# Altium schematic sheet Main_Circuit.SchDoc
size A; SheetNumber: 1; SheetTotal: 1
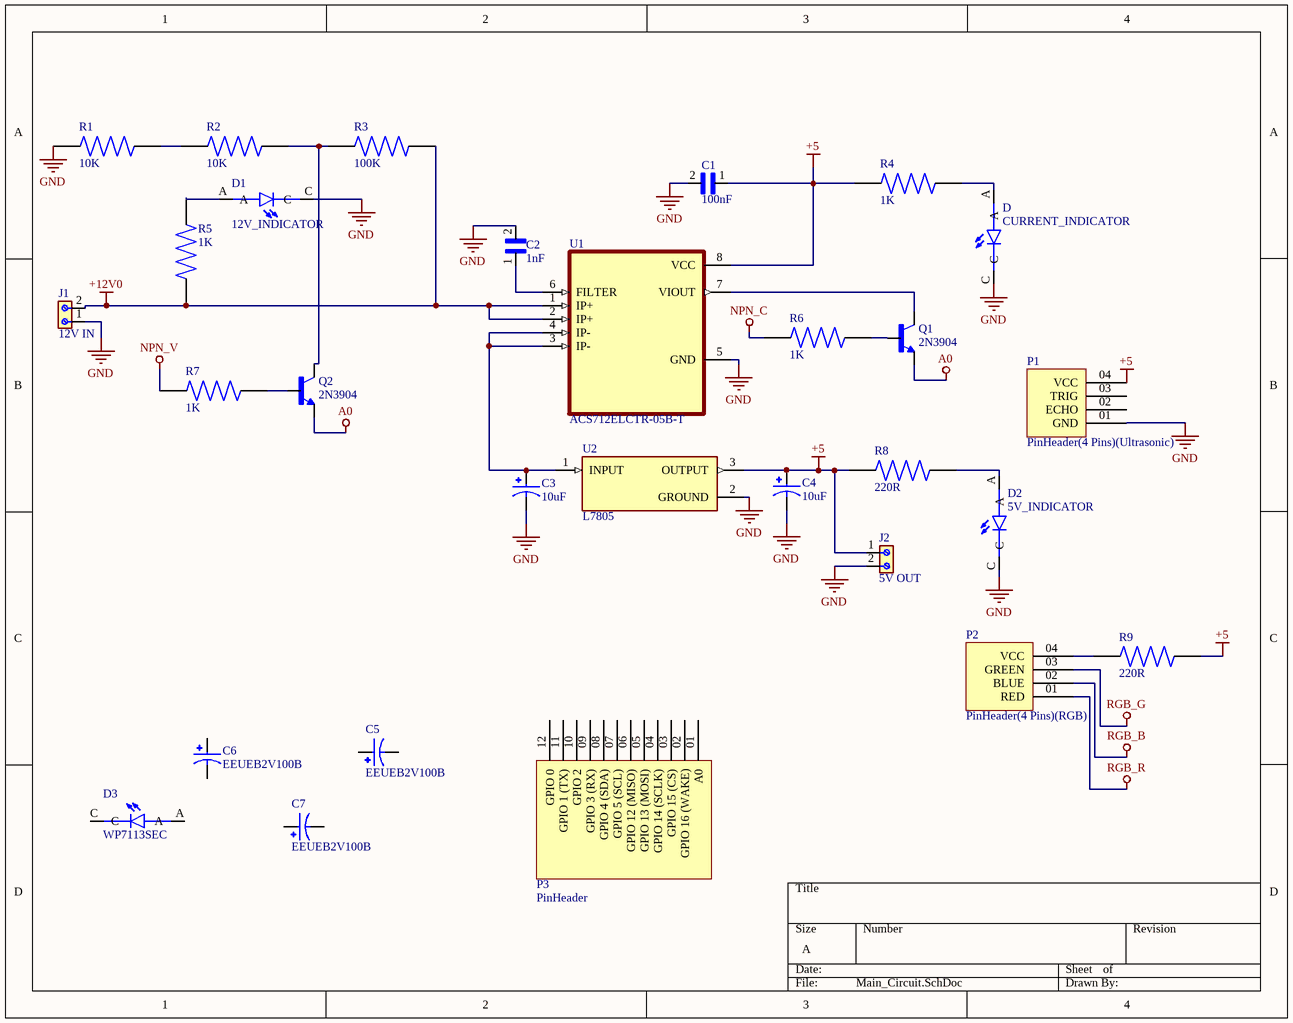
[diagram p0: Main_Circuit.SchDoc]

## Parts
C1  100nF  [CAPRR508W50L508T318H762]
C2  1nF  [CAPRR508W50L508T318H762]
C3  10uF  [CAPPRD500W60D1000H2000]
C4  10uF  [CAPPRD500W60D1000H2000]
C5  EEUEB2V100B  [CAPPRD500W60D1000H2000]
C6  EEUEB2V100B  [CAPPRD500W60D1000H2000]
C7  EEUEB2V100B  [CAPPRD500W60D1000H2000]
D  CURRENT_INDICATOR  [LED_WP7113SEC]
D1  12V_INDICATOR  [LED_WP7113SEC]
D2  5V_INDICATOR  [LED_WP7113SEC]
D3  WP7113SEC  [LED_WP7113SEC]
J1  12V IN  [691253410002]
J2  5V OUT  [691253410002]
P1  PinHeader(4 Pins)(Ultrasonic)  [4 pins connector]
P2  PinHeader(4 Pins)(RGB)  [4 pins connector]
P3  PinHeader  [12 pins connector]
Q1  2N3904  [TO92127P495H495-3]
Q2  2N3904  [TO92127P495H495-3]
R1  10K  [RESAD1100W55L680D260]
R2  10K  [RESAD1100W55L680D260]
R3  100K  [RESAD1100W55L680D260]
R4  1K  [RESAD1100W55L680D260]
R5  1K  [RESAD1100W55L680D260]
R6  1K  [RESAD1100W55L680D260]
R7  1K  [RESAD1100W55L680D260]
R8  220R  [RESAD1100W55L680D260]
R9  220R  [RESAD1100W55L680D260]
U1  ACS712ELCTR-05B-T  [SOIC127P600X175-8N - duplicate]
U2  L7805  [TO255P1020X450X2000-3]

## Nets
+5: C1.1 C4.P J2.1 P1.04(VCC) R4.1 R8.2 R9.1 U1.8(VCC) U2.3(OUTPUT)
+12V0: J1.2 R3.2 R5.1 U1.1(IP+) U1.2(IP+)
A0: Q1.1(E) Q2.1(E)
GND: C1.2 C2.2 C3.N C4.N D.C D1.C D2.C J1.1 J2.2 P1.01(GND) R1.1 U1.5(GND) U2.2(GROUND)
NPN_C: R6.1
NPN_V: R7.1
RGB_B: P2.02(BLUE)
RGB_G: P2.03(GREEN)
RGB_R: P2.01(RED)
NetC2_1: C2.1 U1.6(FILTER)
NetC3_P: C3.P U1.3(IP-) U1.4(IP-) U2.1(INPUT)
NetD1_A: D1.A R5.2
NetD2_A: D2.A R8.1
NetD_A: D.A R4.2
NetP2_04: P2.04(VCC) R9.2
NetQ1_2: Q1.2(B) R6.2
NetQ1_3: Q1.3(C) U1.7(VIOUT)
NetQ2_2: Q2.2(B) R7.2
NetQ2_3: Q2.3(C) R2.2 R3.1
NetR1_2: R1.2 R2.1

Not connected (* = marked no-connect by the designer): C5 N P; C6 N P; C7 N P; D3 A C; P1 02(ECHO) 03(TRIG); P3 01(A0) 02(GPIO_16_(WAKE)) 03(GPIO_15_(CS)) 04(GPIO_14_(SCLK)) 05(GPIO_13_(MOSI)) 06(GPIO_12_(MISO)) 07(GPIO_5_(SCL)) 08(GPIO_4_(SDA)) 09(GPIO_3_(RX)) 10(GPIO_2) 11(GPIO_1_(TX)) 12(GPIO_0)

## Library data of the parts
C1 C2 = FG24X7R2A104KNT00: Cap Ceramic 0.1uF 100V X7R 10% Radial 5mm 125Â°C Bulk; MF: TDK; Package: Radial TDK; MP: FG24X7R2A104KNT00; Purchase-URL: https://pricing.snapeda.com/search/part/FG24X7R2A104KNT00/?ref=eda; Check_prices: https://www.snapeda.com/parts/FG24X7R2A104KNT00/TDK/view-part/?ref=eda; Availability: In Stock; Price: None; SnapEDA_Link: https://www.snapeda.com/parts/FG24X7R2A104KNT00/TDK/view-part/?ref=snap
  C1: Value: 100nF
  C2: Value: 1nF
C3-C7 = EEUEB2V100B: Aluminum Electrolytic Capacitors - Radial Leaded 10uF 350volts AEC-Q200; MF: Panasonic; MP: EEU-EB2V100B; Price: None; Check_prices: https://www.snapeda.com/parts/EEU-EB2V100B/Panasonic/view-part/?ref=eda; SnapEDA_Link: https://www.snapeda.com/parts/EEU-EB2V100B/Panasonic/view-part/?ref=snap; Availability: In Stock; Package: RADIAL-2 Panasonic
  C3 C4: Value: 10uF
  C5-C7: Value: *
D D1-D3 = WP7113SEC: Red 625nm LED Indication - Discrete 2.2V Radial; MF: Kingbright; Arrow_Electronics-Purchase-URL: https://snapeda.com/shop?store=Arrow+Electronics&id=1233302; Value: *; SnapEDA_Link: https://www.snapeda.com/parts/WP7113SEC/Kingbright/view-part/1233302/?ref=snap; DigiKey-Purchase-URL: https://snapeda.com/shop?store=DigiKey&id=1233302; Package: Radial Kingbright; MP: WP7113SEC; Mouser-Purchase-URL: https://snapeda.com/shop?store=Mouser&id=1233302; Price: None; Availability: Good
J1 J2 = 691253410002: 7.62 MM TERMINAL BLOCK, HORIZONT; MF: WÃ¼rth Elektronik; Package: None; Price: None; Check_prices: https://www.snapeda.com/parts/691253410002/Wurth+Electronics+Inc./view-part/?ref=eda; Value: *; SnapEDA_Link: https://www.snapeda.com/parts/691253410002/Wurth+Electronics+Inc./view-part/?ref=snap; MP: 691253410002; Availability: In Stock; Purchase-URL: https://pricing.snapeda.com/search?q=691253410002&ref=eda
Q1 Q2 = 2N3904: TRANS NPN 40V 200MA TO92-3; MF: Rectron; SnapEDA_Link: https://www.snapeda.com/parts/2N3904/Rectron/view-part/?ref=snap; Package: TO-226-3 Rectron; MP: 2N3904; Check_prices: https://www.snapeda.com/parts/2N3904/Rectron/view-part/?ref=eda; Purchase-URL: https://pricing.snapeda.com/search/part/2N3904/?ref=eda; Price: None; Value: *; Availability: In Stock
R1-R9 = MFR-25FBF52-3K16: RES 280K OHM 1/4W 1% AXIAL; Package: None; Price: None; MP: MFR-25FBF52-3K16; Availability: Unavailable
  R1 R2: Value: 10K
  R3: Value: 100K
  R4-R7: Value: 1K
  R8 R9: Value: 220R
U1 = ACS712ELCTR-05B-T: Current Sensor 5A 1 Channel Hall Effect, Open Loop Bidirectional 8-SOIC (0.154, 3.90mm Width); MF: Allegro MicroSystems LLC; SnapEDA_Link: https://www.snapeda.com/parts/ACS712ELCTR-05B-T/Allegro+MicroSystems+LLC/view-part/?ref=snap; Package: SOIC-8 Allegro MicroSystems LLC; MP: ACS712ELCTR-05B-T; Check_prices: https://www.snapeda.com/parts/ACS712ELCTR-05B-T/Allegro+MicroSystems+LLC/view-part/?ref=eda; Purchase-URL: https://pricing.snapeda.com/search/part/ACS712ELCTR-05B-T/?ref=eda; Price: None; Value: *; Availability: In Stock
U2 = L7805: Standard Regulator Pos 5V 1.5A 3-Pin(3+Tab) TO-220FP Tube; MF: STMicroelectronics; MP: L7805; Value: *; SnapEDA_Link: https://www.snapeda.com/parts/L7805/STMicroelectronics/view-part/?ref=snap; Price: None; Package: None; Check_prices: https://www.snapeda.com/parts/L7805/STMicroelectronics/view-part/?ref=eda; Availability: Not in stock